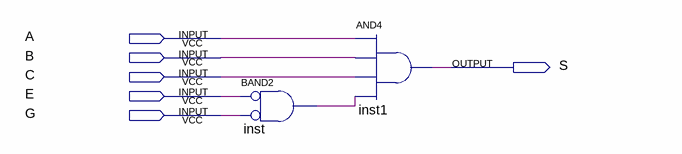
[diagram p0: schematic sheet]
// Quartus schematic Block12.bdf as structural Verilog: 2 symbols, 6 pins
module Block12 (
  input  A,
  input  B,
  input  C,
  input  E,
  input  G,
  output S
);

  wire inst_out;

  and inst (inst_out, ~E, ~G);  // BAND2
  and inst1 (S, A, B, C, inst_out);
endmodule
